# Altium schematic sheet 12_OUT.SchDoc
size A4; Date: 10; PageSetup: Record=PageOptions|CenterHorizontal=True|CenterVertical=True|PrintScale=0.97|XCorrection=1.00|YCorrection=1.00|PrintKind=0|BorderSize=5000000|LeftOffset=0|BottomOffset=0|Orientation=2|PaperLength=1000|PaperWidth=1000|Scale=100|PaperSource=7|PrintQuality=-4|MediaType=1|DitherType=10|PaperKind=A4|PrintScaleMode=1
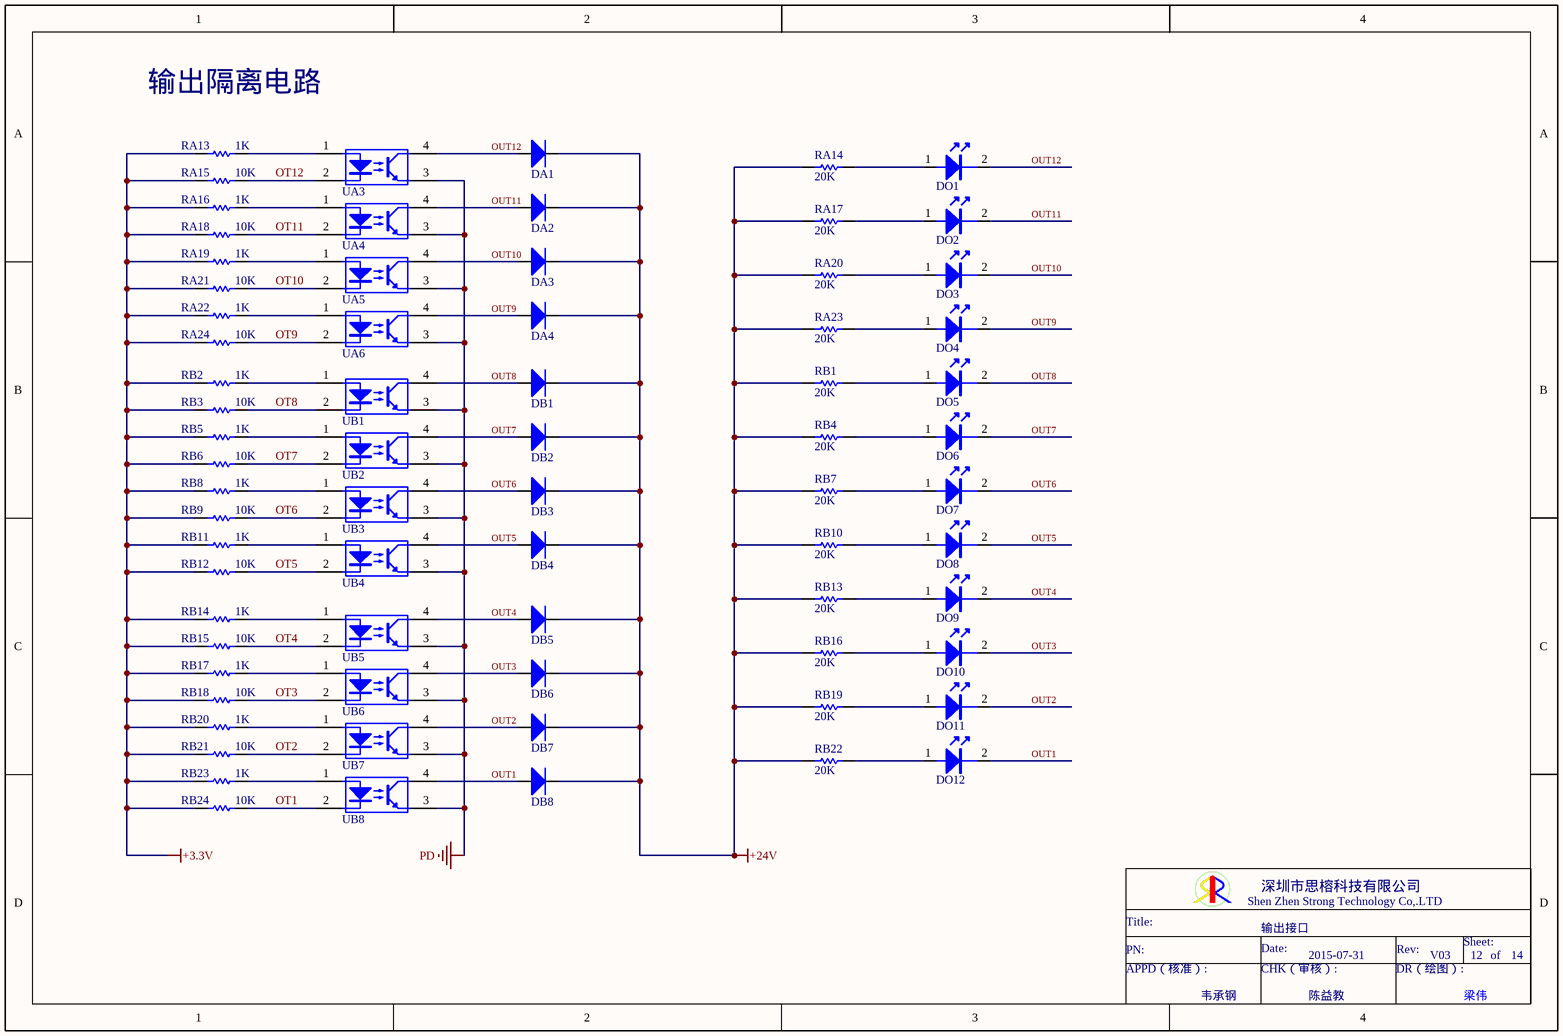
[diagram p0: 12_OUT.SchDoc]

## Parts
DA1  IN4148W T4  [1206D]  (value not drawn)
DA2  IN4148W T4  [1206D]  (value not drawn)
DA3  IN4148W T4  [1206D]  (value not drawn)
DA4  IN4148W T4  [1206D]  (value not drawn)
DB1  IN4148W T4  [1206D]  (value not drawn)
DB2  IN4148W T4  [1206D]  (value not drawn)
DB3  IN4148W T4  [1206D]  (value not drawn)
DB4  IN4148W T4  [1206D]  (value not drawn)
DB5  IN4148W T4  [1206D]  (value not drawn)
DB6  IN4148W T4  [1206D]  (value not drawn)
DB7  IN4148W T4  [1206D]  (value not drawn)
DB8  IN4148W T4  [1206D]  (value not drawn)
DO1  LED灯 白发红光  [D0603]  (value not drawn)
DO2  LED灯 白发红光  [D0603]  (value not drawn)
DO3  LED灯 白发红光  [D0603]  (value not drawn)
DO4  LED灯 白发红光  [D0603]  (value not drawn)
DO5  LED灯 白发红光  [D0603]  (value not drawn)
DO6  LED灯 白发红光  [D0603]  (value not drawn)
DO7  LED灯 白发红光  [D0603]  (value not drawn)
DO8  LED灯 白发红光  [D0603]  (value not drawn)
DO9  LED灯 白发红光  [D0603]  (value not drawn)
DO10  LED灯 白发红光  [D0603]  (value not drawn)
DO11  LED灯 白发红光  [D0603]  (value not drawn)
DO12  LED灯 白发红光  [D0603]  (value not drawn)
RA13  1K  [0603R]
RA14  20K  [0603R]
RA15  10K  [0603R]
RA16  1K  [0603R]
RA17  20K  [0603R]
RA18  10K  [0603R]
RA19  1K  [0603R]
RA20  20K  [0603R]
RA21  10K  [0603R]
RA22  1K  [0603R]
RA23  20K  [0603R]
RA24  10K  [0603R]
RB1  20K  [0603R]
RB2  1K  [0603R]
RB3  10K  [0603R]
RB4  20K  [0603R]
RB5  1K  [0603R]
RB6  10K  [0603R]
RB7  20K  [0603R]
RB8  1K  [0603R]
RB9  10K  [0603R]
RB10  20K  [0603R]
RB11  1K  [0603R]
RB12  10K  [0603R]
RB13  20K  [0603R]
RB14  1K  [0603R]
RB15  10K  [0603R]
RB16  20K  [0603R]
RB17  1K  [0603R]
RB18  10K  [0603R]
RB19  20K  [0603R]
RB20  1K  [0603R]
RB21  10K  [0603R]
RB22  20K  [0603R]
RB23  1K  [0603R]
RB24  10K  [0603R]
UA3  AQY212GS  [SOP4-2.54]  (value not drawn)
UA4  AQY212GS  [SOP4-2.54]  (value not drawn)
UA5  AQY212GS  [SOP4-2.54]  (value not drawn)
UA6  AQY212GS  [SOP4-2.54]  (value not drawn)
UB1  AQY212GS  [SOP4-2.54]  (value not drawn)
UB2  AQY212GS  [SOP4-2.54]  (value not drawn)
UB3  AQY212GS  [SOP4-2.54]  (value not drawn)
UB4  AQY212GS  [SOP4-2.54]  (value not drawn)
UB5  AQY212GS  [SOP4-2.54]  (value not drawn)
UB6  AQY212GS  [SOP4-2.54]  (value not drawn)
UB7  AQY212GS  [SOP4-2.54]  (value not drawn)
UB8  AQY212GS  [SOP4-2.54]  (value not drawn)

## Nets
+3.3V: RA13.1 RA15.1 RA16.1 RA18.1 RA19.1 RA21.1 RA22.1 RA24.1 RB2.1 RB3.1 RB5.1 RB6.1 RB8.1 RB9.1 RB11.1 RB12.1 RB14.1 RB15.1 RB17.1 RB18.1 RB20.1 RB21.1 RB23.1 RB24.1
+24V: DA1.2 DA2.2 DA3.2 DA4.2 DB1.2 DB2.2 DB3.2 DB4.2 DB5.2 DB6.2 DB7.2 DB8.2 RA14.1 RA17.1 RA20.1 RA23.1 RB1.1 RB4.1 RB7.1 RB10.1 RB13.1 RB16.1 RB19.1 RB22.1
PD: UA3.3(Emitter) UA4.3(Emitter) UA5.3(Emitter) UA6.3(Emitter) UB1.3(Emitter) UB2.3(Emitter) UB3.3(Emitter) UB4.3(Emitter) UB5.3(Emitter) UB6.3(Emitter) UB7.3(Emitter) UB8.3(Emitter)
OT1: RB24.2 UB8.2(LED_Cathode)
OT2: RB21.2 UB7.2(LED_Cathode)
OT3: RB18.2 UB6.2(LED_Cathode)
OT4: RB15.2 UB5.2(LED_Cathode)
OT5: RB12.2 UB4.2(LED_Cathode)
OT6: RB9.2 UB3.2(LED_Cathode)
OT7: RB6.2 UB2.2(LED_Cathode)
OT8: RB3.2 UB1.2(LED_Cathode)
OT9: RA24.2 UA6.2(LED_Cathode)
OT10: RA21.2 UA5.2(LED_Cathode)
OT11: RA18.2 UA4.2(LED_Cathode)
OT12: RA15.2 UA3.2(LED_Cathode)
OUT1: DB8.1 DO12.2 UB8.4(Collector)
OUT2: DB7.1 DO11.2 UB7.4(Collector)
OUT3: DB6.1 DO10.2 UB6.4(Collector)
OUT4: DB5.1 DO9.2 UB5.4(Collector)
OUT5: DB4.1 DO8.2 UB4.4(Collector)
OUT6: DB3.1 DO7.2 UB3.4(Collector)
OUT7: DB2.1 DO6.2 UB2.4(Collector)
OUT8: DB1.1 DO5.2 UB1.4(Collector)
OUT9: DA4.1 DO4.2 UA6.4(Collector)
OUT10: DA3.1 DO3.2 UA5.4(Collector)
OUT11: DA2.1 DO2.2 UA4.4(Collector)
OUT12: DA1.1 DO1.2 UA3.4(Collector)
NetDO1_1: DO1.1 RA14.2
NetDO2_1: DO2.1 RA17.2
NetDO3_1: DO3.1 RA20.2
NetDO4_1: DO4.1 RA23.2
NetDO5_1: DO5.1 RB1.2
NetDO6_1: DO6.1 RB4.2
NetDO7_1: DO7.1 RB7.2
NetDO8_1: DO8.1 RB10.2
NetDO9_1: DO9.1 RB13.2
NetDO10_1: DO10.1 RB16.2
NetDO11_1: DO11.1 RB19.2
NetDO12_1: DO12.1 RB22.2
NetRA13_2: RA13.2 UA3.1(LED_Anode)
NetRA16_2: RA16.2 UA4.1(LED_Anode)
NetRA19_2: RA19.2 UA5.1(LED_Anode)
NetRA22_2: RA22.2 UA6.1(LED_Anode)
NetRB2_2: RB2.2 UB1.1(LED_Anode)
NetRB5_2: RB5.2 UB2.1(LED_Anode)
NetRB8_2: RB8.2 UB3.1(LED_Anode)
NetRB11_2: RB11.2 UB4.1(LED_Anode)
NetRB14_2: RB14.2 UB5.1(LED_Anode)
NetRB17_2: RB17.2 UB6.1(LED_Anode)
NetRB20_2: RB20.2 UB7.1(LED_Anode)
NetRB23_2: RB23.2 UB8.1(LED_Anode)

## Notes on the sheet
- 输出隔离电路
- 输出接口
- 2015-07-31
- V03
- 12
- 14
- 韦承钢
- 陈益教
- Shen Zhen Strong Technology Co,.LTD
- 深圳市思榕科技有限公司
- Title:
- PN:
- APPD（核准）:
- Date:
- CHK（审核）:
- DR（绘图）:
- Rev:
- Sheet:
- of
- 梁伟

## Library data of the parts
DA1-DA4 DB1-DB8 = D: 二极管
DO1-DO12 = LED: LED灯
RA13-RA24 RB1-RB24 = RES
UA3-UA6 UB1-UB8 = TLP281